# Altium schematic sheet Power Supply.SchDoc
size A3; SheetNumber: 3; SheetTotal: 3
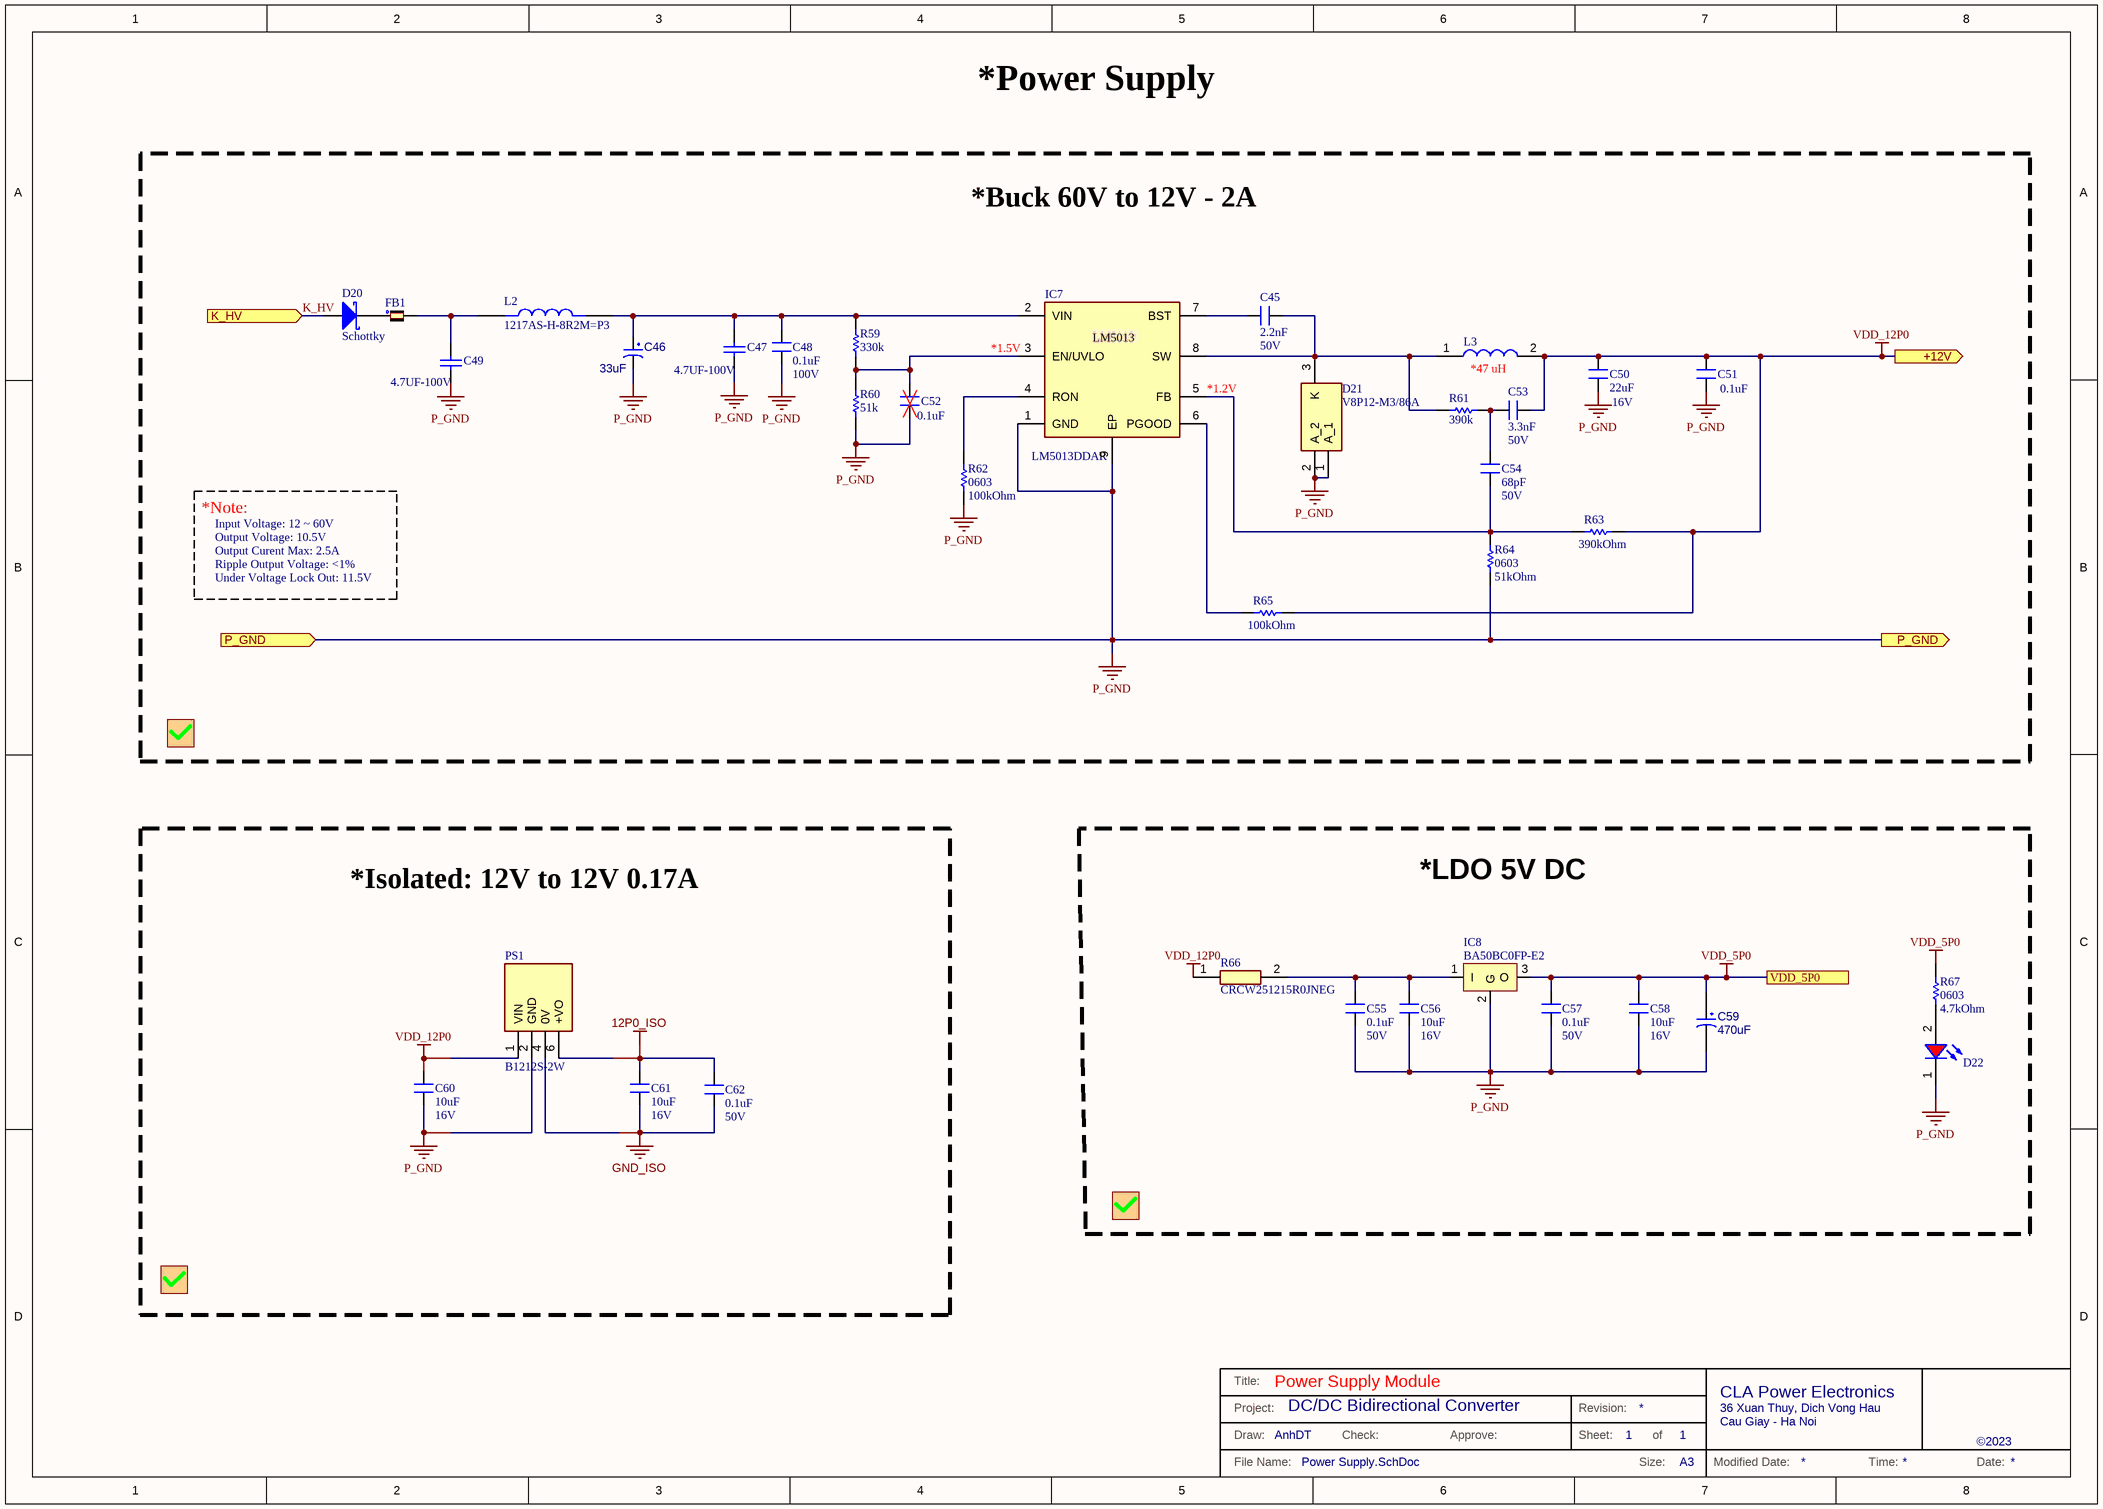
[diagram p0: Power Supply.SchDoc]

## Parts
C45  2.2nF  value 50V  [C_0603]
C46  value 33uF  [C_ALU_TH_8p0D11p5]  (hidden comment: Cap_Alu_TH_8P0D3P5_22uF)
C47  value 4.7UF-100V  [C_1210]  (hidden comment: GRM32ER71K475KE14L)
C48  0.1uF  value 100V  [C_0805]
C49  value 4.7UF-100V  [C_1210]  (hidden comment: GRM32ER71K475KE14L)
C50  22uF  value 16V  [C_1210]
C51  value 0.1uF  [C_0603]  (hidden comment: 0603)
C52  value 0.1uF  [C_0603]  (hidden comment: 0603)
C53  3.3nF  value 50V  [C_0603]
C54  68pF  value 50V  [C_0603]
C55  0.1uF  value 50V  [C_0603]
C56  10uF  value 16V  [C_0805]
C57  0.1uF  value 50V  [C_0603]
C58  10uF  value 16V  [C_0805]
C59  value 470uF  [C_ALU_TH_8p0D11p5]  (hidden comment: Cap_Alu_TH_8P0D3P5)
C60  10uF  value 16V  [C_0805]
C61  10uF  value 16V  [C_0805]
C62  0.1uF  value 50V  [C_0603]
D20  Schottky  [DIODE_Schottky_DO214]
D21  V8P12-M3/86A  [V8P12M386A]
D22  LED-SMD  [SM-LED-0805-Red]  (value not drawn)
FB1  FerriteBead_1206_270Ohm  [FERRITEBEAD_1206]  (value not drawn)
IC7  LM5013DDAR  [SOIC127P600X170-9N]
IC8  BA50BC0FP-E2  [TO252-123]
L2  1217AS-H-8R2M=P3  [IND_1217AS-H-8R2M=P3]
L3  (no value)  [SRR1260A470M]
PS1  B1212S-2W  [B1212S2W]
R59  330k  [R_0603]
R60  51k  [R_0603]
R61  390k  [R_0603]
R62  0603  value 100kOhm  [R_0603]
R63  value 390kOhm  [R_0603]  (hidden comment: 0603)
R64  0603  value 51kOhm  [R_0603]
R65  value 100kOhm  [R_0603]  (hidden comment: 0603)
R66  CRCW251215R0JNEG  [RESC6332X70N]
R67  0603  value 4.7kOhm  [R_0603]

## Blocks framed on the sheet
*Buck 60V to 12V - 2A: C45-C54 D20 D21 FB1 IC7 L2 L3 R59-R65
*Isolated: 12V to 12V 0.17A: C60-C62 PS1
*LDO 5V DC: C55-C59 D22 IC8 R66 R67

## Ports
+12V (out), K_HV (in), P_GND (in), P_GND (out), VDD_5P0

## Nets
12P0_ISO: C61.2 C62.2 PS1.6(+VO)
GND_ISO: C61.1 C62.1 PS1.4(0V)
P_GND: C46.2 C47.1 C48.1 C49.1 C50.1 C51.1 C52.2 C55.1 C56.1 C57.1 C58.1 C59.2 C60.1 D21.1(A_1) D21.2(A_2) D22.1(K) IC7.1(GND) IC7.9(EP) IC8.2(G) PS1.2(GND) R60.1 R62.1 R64.1 ; port P_GND
VDD_5P0: C57.2 C58.2 C59.1 IC8.3(O) R67.2 ; port VDD_5P0
VDD_12P0: C50.2 C51.2 C53.2 C60.2 L3.2 PS1.1(VIN) R63.2 R65.1 R66.1 ; port +12V
K_HV: D20.1(A) ; port K_HV
NetC45_1: C45.1 D21.3(K) IC7.8(SW) L3.1 R61.2
NetC45_2: C45.2 IC7.7(BST)
NetC46_1: C46.1 C47.2 C48.2 IC7.2(VIN) L2.2 R59.2
NetC49_2: C49.2 FB1.2 L2.1
NetC52_1: C52.1 IC7.3(EN/UVLO) R59.1 R60.2
NetC53_1: C53.1 C54.2 R61.1
NetC54_1: C54.1 IC7.5(FB) R63.1 R64.2
NetC55_2: C55.2 C56.2 IC8.1(I) R66.2
NetD20_2: D20.2(K) FB1.1
NetD22_2: D22.2(A) R67.1
NetIC7_4: IC7.4(RON) R62.2
NetIC7_6: IC7.6(PGOOD) R65.2

## Notes on the sheet
- *Power Supply
- (near IC7) *1.5V
- (near IC7) LM5013
- (near L3) *47 uH
- (near IC7) *1.2V
- *Note:
- Output Curent Max: 2.5A
- Under Voltage Lock Out: 11.5V
- Input Voltage: 12 ~ 60V
- Output Voltage: 10.5V
- Ripple Output Voltage: <1%
- Title:
- Power Supply Module
- CLA Power Electronics
- Project:
- Draw:
- AnhDT
- DC/DC Bidirectional Converter
- Check:
- Approve:
- Revision:
- Sheet:
- 1
- of
- 36 Xuan Thuy, Dich Vong Hau
- Cau Giay - Ha Noi
- ©2023
- File Name:
- Size:
- A3
- Modified Date:
- Time:
- Date:
- (in symbol LM5012DDAR) LM5012

## Library data of the parts
C45 = Cap_Cer_0805_10pF: CAP CER 2.2nF 50V X7R 0805; Manufacturer: Samsung Electro-Mechanics; Part Number: C0805C222J5GEC7800; Part Code: S1200-000116; Description SEL: CAP CER 2.2nF 50V X7R 0603; Point: 2; Footprint Type: SMD
C46 = S1200-000209: CAP ALUM 33UF 20% 80V RADIAL; Manufacturer: PANASONIC; Part Number: 80ZLH33MEFC6.3X11; Point: 2; Description SEL: CAP ALUM 33UF 20% 80V RADIAL; Footprint Type: TH; Part Code: S1200-000209; Component Kind: Standard
C47 C49 = Cap 1210: CAP CER 4.7uF 80V X7R 1210; Manufacturer: TDK Corporation; Description std: CAP CER 4.7UF 100V X7S 1210; Category: Capacitors; Part Number: GRM32ER71K475KE14L; Link: https://www.digikey.com/product-detail/en/tdk-corporation/C3225X7S2A475M200AB/445-6043-2-ND/2443521; Digikey Price/1KU: 0.56250; Package: 1210; Digikey Price/1unit: 1.64
C48 = Cap_Cer_0805_10pF: CAP CER 0.1uF 100V X7R 0805; Manufacturer: Samsung Electro-Mechanics; Part Code: S1200-000116; Point: 2; Footprint Type: SMD
C50 = Cap_Cer_0805_10pF: CAP CER 22uF 16V X7R 1210; Manufacturer: Samsung Electro-Mechanics; Part Number: CL32A226KOJNNNE; Part Code: S1200-000116; Point: 2; Description SEL: CAP CER 22uF 16V X7R 1210; Footprint Type: SMD
C51 = Cap_Cer_0603_0.1uF_25V: CAP CER 0.1UF 25V X8R 0603; Manufacturer: Murata Electronics; Part Number: GCM188R91E104KA37J; Part Code: S1200-000077; Point: 2; Description SEL: CAP CER 0.1UF 25V X8R 0603; Footprint Type: SMD
C52 = Cap_Cer_0603_0.1uF_100V: CAP CER 0.1UF 100V X7R 0603; Manufacturer: Murata Electronics; Part Number: GRM188R72A104KA35D; Part Code: S1200-000079; Point: 2; Description SEL: CAP CER 0.1UF 100V X7R 0603; Footprint Type: SMD
C53 = Cap_Cer_0805_10pF: CAP CER 0805 3.3NF 50V C0G 1%; Manufacturer: Kemet; Part Number: C0805C332F5GECAUTO; Part Code: S1200-000116; Description SEL: 10pF 50VDC; Point: 2; Footprint Type: SMD
C54 = Cap_Cer_0805_10pF: CAP CER 68pF 50V C0G 0603; Manufacturer: Kemet; Part Number: CL10C680JB81PNC; Part Code: S1200-000116; Point: 2; Description SEL: CAP CER 68pF 50V C0G 0603; Footprint Type: SMD
C55 C57 C62 = Cap_Cer_0805_10pF: CAP CER 0.1uF 50V X7R 0603; Manufacturer: Kemet; Part Number: CL10C680JB81PNC; Part Code: S1200-000116; Description SEL: CAP CER 68pF 50V C0G 0603; Point: 2; Footprint Type: SMD
C56 C58 = Cap_Cer_0805_10pF: CAP CER 10uF 16V X7R 0805; Manufacturer: Kemet; Part Number: CL21A106KOCLRNC; Part Code: S1200-000116; Point: 2; Description SEL: CAP CER 10uF 16V X7R 0805; Footprint Type: SMD
C59 = S1200-000039: CAP ALUM 470UF 20% 25V RADIAL; Manufacturer: Rubycon; Part Number: 16YXJ220MT16.3X11; Point: 2; Description SEL: CAP ALUM 470UF 20% 25V RADIAL; Footprint Type: TH; Part Code: S1200-000039; Component Kind: Standard
C60 = Cap_Cer_0805_10pF: CAP CER 2.2uF 50V X7R 0805; Manufacturer: Samsung Electro-Mechanics; Part Number: CL31B225KBHNNNE; Part Code: S1200-000116; Description SEL: 10pF 50VDC; Point: 2; Footprint Type: SMD
C61 = Cap_Cer_0805_10pF: CAP CER 4.7uF 50V X7R 0805; Manufacturer: Samsung Electro-Mechanics; Part Number: CL31B225KBHNNNE; Part Code: S1200-000116; Description SEL: 10pF 50VDC; Point: 2; Footprint Type: SMD
D20 = SS34: DIODE SCHOTTKY 100V 3A SMA; Manufacturer: SMC Diode Solutions; Part Number: SS310; Part Code: S1500-000030; Value: 3A 100V; Point: 2; Description SEL: DIODE SCHOTTKY 100V 3A SMA; Footprint Type: SMA; Packaging: DIODE_Schottky_DO214
D21 = V8P12-M3_86A: DIODE SCHOTTKY 120V 8A TO277A; Manufacturer_Name: Vishay; Datasheet Link: https://www.vishay.com/docs/89170/v8p12.pdf; Height: 1.2mm; Part Number: V8P12-M3/86A; Mouser Part Number: 78-V8P12-M3/86A; Mouser Price/Stock: https://www.mouser.co.uk/ProductDetail/Vishay-General-Semiconductor/V8P12-M3-86A?qs=HSPD0Bff7iYR%2FGS73JOLOg%3D%3D; Arrow Part Number: V8P12-M3/86A; Arrow Price/Stock: https://www.arrow.com/en/products/v8p12-m386a/vishay?region=nac
D22 = LED-SMD: LED RED DIFFUSED 0805 SMD; Manufacturer: OSRAM Opto Semiconductors Inc.; Part Number: LS R976-NR-1; Category: LED; Footprint type: SMD
FB1 = FerriteBead_1206_270Ohm: FERRITE BEAD 270 OHM 1206 1LN; Manufacturer: Murata Electronics; Part Number: BLM31KN271SH1L; Part Code: S1100-000016; Point: 2; Value: 270Ohm; Description SEL: FERRITE BEAD 270 OHM 1206 1LN; Footprint Type: SMD
IC7 = LM5012DDAR: IC REG BUCK ADJ 3.5A 8SO PWR; Part Number: LM5013DDAR
IC8 = BA50BC0FP-E2: IC REG LINEAR 5V 1A TO252-2; Manufacture: Rohm Semiconductor; ComponentLink1Description: Manufacturer Link; ComponentLink1URL: http://www.st.com/; ComponentLink2Description: Datasheet; ComponentLink2URL: http://www.st.com/stonline/products/literature/ds/2146/l78m05c.pdf; Footprint type: SMD; Category: IC; Part Number: BA50BC0FP-E2
L2 = 1217AS-H-8R2M=P3: Inductor with Inductance: 8.2uH Tol. +/-20%, Package: 3131 (8080); MF: Murata; Price: None; Value: *; Arrow_Electronics-Purchase-URL: https://snapeda.com/shop?store=Arrow+Electronics&id=4547222; MP: 1217AS-H-8R2M=P3; Package: NONSTANDARD; SnapEDA_Link: https://www.snapeda.com/parts/1217AS-H-8R2M=P3/Murata/view-part/4547222/?ref=snap; Mouser-Purchase-URL: https://snapeda.com/shop?store=Mouser&id=4547222; Availability: Warning
L3 = Inductor: FIXED IND 47UH 2.5A 100 MOHM SMD; Manufacturer: Taiyo Yuden; Part Number: CDRH127-470; Footprint: Nonstandard; Footprint type: SMD; Category: Inductor
PS1 = B1212S-2W: Power Supply; Manufacturer_Name: Mornsun Power; Datasheet Link: https://www.mornsun-power.com/public/uploads/pdf/B_S-2WR3.pdf; Height: 10.41mm; Manufacturer_Part_Number: B1212S-2W
R59 = Resistor_0603_10Ohm 1%: RES 200K OHM 1% 1/10W 0603; Manufacturer: YAGEO; Part Number: RC0603FR-13200KL; Part Code: S1100-000044; Point: 2; Power: 1/8W; Description SEL: RES 200K OHM 1% 1/10W 0603; Footprint Type: SMD; Tolerance: 1%
R60 = Resistor_0603_10Ohm 1%: RES 24k OHM 1% 1/8W 0603; Manufacturer: YAGEO; Part Number: RC0603FR-1024KL; Part Code: S1100-000044; Description SEL: RES 24K OHM 1% 1/10W 0603; Point: 2; Value: 8.2-10kOhm; Footprint Type: SMD; Power: 1/8W; Tolerance: 1%
R61 = Resistor_0603_10Ohm 1%: RES 390k OHM 1% 1/8W 0603; Manufacturer: YAGEO; Part Number: RC0603FR-07390KL; Part Code: S1100-000044; Description SEL: RES 390K OHM 1% 1/10W 0603; Point: 2; Footprint Type: SMD; Power: 1/8W; Tolerance: 1%
R62 R65 = Resistor_0603_100kOhm: RES SMD 100K OHM 1% 1/8W 0603; Manufacturer: Vishay Beyschlag/Draloric/BC Components; Part Number: MCT06030C1003FP500; Part Code: S1100-000051; Point: 2; Description SEL: RES SMD 100K OHM 1% 1/8W 0603; Footprint Type: SMD; Power: 1/8W; Tolerance: 1%
R63 = Resistor_0603_470kOhm: RES SMD 470K OHM 1% 1/10W 0603; Manufacturer: Walsin Technology Corporation; Part Code: S1100-000056; Point: 2; Description SEL: RES SMD 470K OHM 1% 1/10W 0603; Footprint Type: SMD; Power: 1/10W; Tolerance: 1%
R64 = Resistor_0603_51kOhm: RES SMD 51K OHM 1% 1/8W 0603; Manufacturer: YAGEO; Part Number: RC0603FR-0751KL; Part Code: S1100-000148; Point: 2; Description SEL: RES SMD 51K OHM 1% 1/8W 0603; Footprint Type: SMD; Power: 1/8W; Tolerance: 1%
R66 = CRCW251215R0JNEG: Manufacturer_Name: Vishay; Datasheet Link: http://www.vishay.com/docs/20035/dcrcwe3.pdf; Height: 0.7mm; Part Number: CRCW251215R0JNEG; Mouser Part Number: 71-CRCW2512J-15-E3; Mouser Price/Stock: https://www.mouser.co.uk/ProductDetail/Vishay-Dale/CRCW251215R0JNEG?qs=Z1AZHWO%2FsqLBwgjNhUTIZA%3D%3D; Arrow Part Number: CRCW251215R0JNEG; Arrow Price/Stock: https://www.arrow.com/en/products/crcw251215r0jneg/vishay
R67 = Resistor_0603_4.7kOhm: RES 2K OHM 1% 1/10W 0603; Manufacturer: YAGEO; Part Number: RC0603FR-074K7L; Part Code: S1100-000158; Description SEL: RES 4.7K OHM 1% 1/10W 0603; Point: 2; Footprint Type: SMD; Power: 1/10W; Tolerance: 1%